# EasyEDA Pro project ProPrj_JoyStick_Base_控制&传感器PCB_2025-09-22.epro

# Schematic axleY_dhs_sch
Board Name: Board1
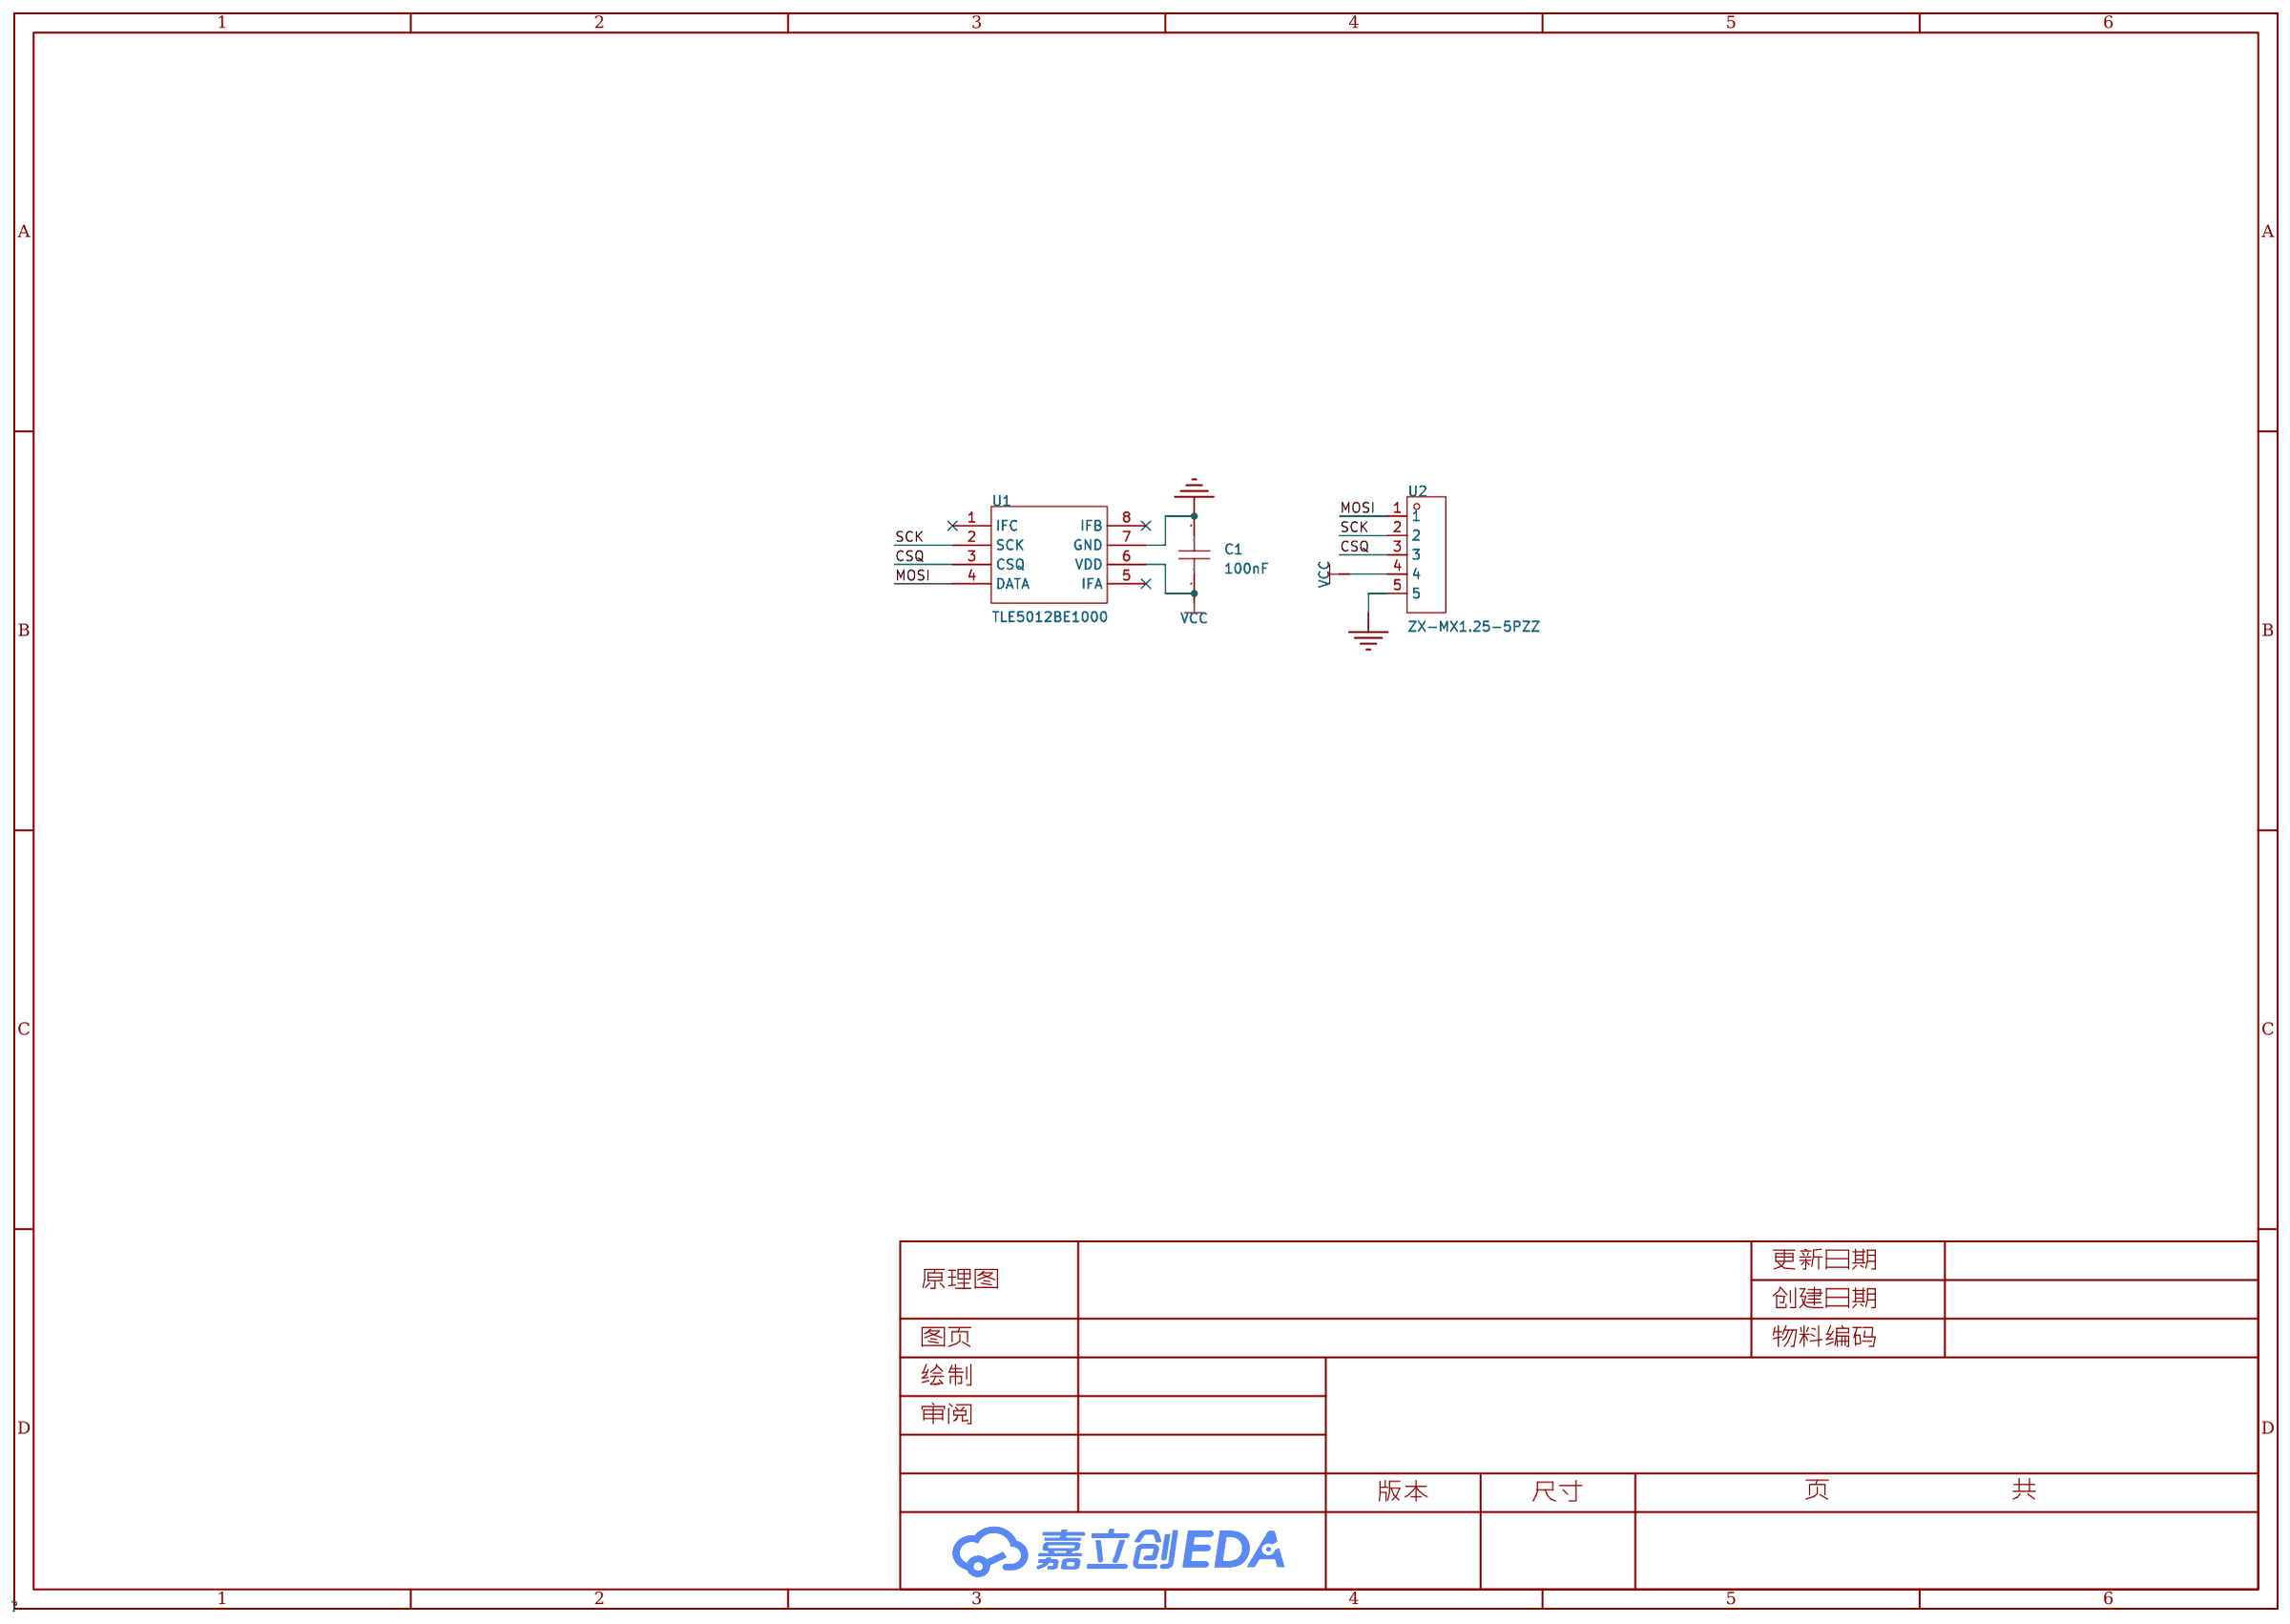
[diagram p0: schematic sheet]

## Parts
C1  100nF  [C0603]
U1  TLE5012BE1000  [PG-DSO-8_L5.0-W4.0-P1.27-LS6.0-BL]
U2  ZX-MX1.25-5PZZ  [CONN-TH_5P-P1.25_L3.2-W8.0]

## Library data of the parts
C1 = CGA0603X7R104K500JT: 容值:100nF;精度:±10%;额定电压:50V;材质(温度系数):X7R;; LCSC Part Name: 100nF ±10% 50V; Supplier Part: C6119867; Manufacturer: HRE(芯声); Supplier Footprint: 0603; JLCPCB Part Class: 扩展库; Supplier: LCSC; Tolerance: ±10%; Voltage Rated: 50V; Temperature Coefficient: X7R
U1 = TLE5012BE1000: 旋转角度范围:0°~360°;; Supplier Part: C123083; Manufacturer: Infineon(英飞凌); Supplier Footprint: SO-8; JLCPCB Part Class: 扩展库; Datasheet: https://atta.szlcsc.com/upload/public/pdf/source/20170728/C123083_1501225763065848823.pdf; Supplier: LCSC; Rotation Angle: 0°~360°
U2 = ZX-MX1.25-5PZZ: 插针结构:1x5P;间距:1.25mm;安装方式:直插;参考系列:-;总PIN数:5P;排数:1;每排PIN数:5;行距:-;额定电流:1A;触头材质:黄铜;触头镀层:锡;工作温度范围:-25℃~+85℃;; LCSC Part Name: 1x5P 间距:1.25mm 直插; Supplier Part: C7430461; Manufacturer: Megastar(兆星); Supplier Footprint: 插件,P=1.25mm; JLCPCB Part Class: Extended Part; Datasheet: https://atta.szlcsc.com/upload/public/pdf/source/20230619/834A82ADC0597DB6BA0EE0E3A3338474.pdf; Supplier: LCSC; Pins Structure: 1x5P; Pitch: 1.25mm; Mounting Style: 直插; Number of Pins: 5P; Number of Rows: 1; Number of PINs Per Row: 5; Current Rating (Max): 1A; Contact Material: 黄铜; Contact Plating: 锡; Operating Temperature Range: -25℃~+85℃

## Nets
GND: C1.2 U1.7(GND) U2.5
VCC: C1.1 U1.6(VDD) U2.4
CSQ: U1.3(CSQ) U2.3
MOSI: U1.4(DATA) U2.1
SCK: U1.2(SCK) U2.2

Not connected (* = marked no-connect by the designer): U1 1(IFC)* 5(IFA)* 8(IFB)*

# Schematic axleZ_dhs_sch
Board Name: Board2; Create Date: 2024-12-11; Page Name: P1; Project Name: JoyStick_Base_控制&传感器PCB; Schematic Name: axleZ_dhs_sch; Update Date: 2025-02-16; Company: 嘉立创EDA; Page Size: A4; Version: V1.0
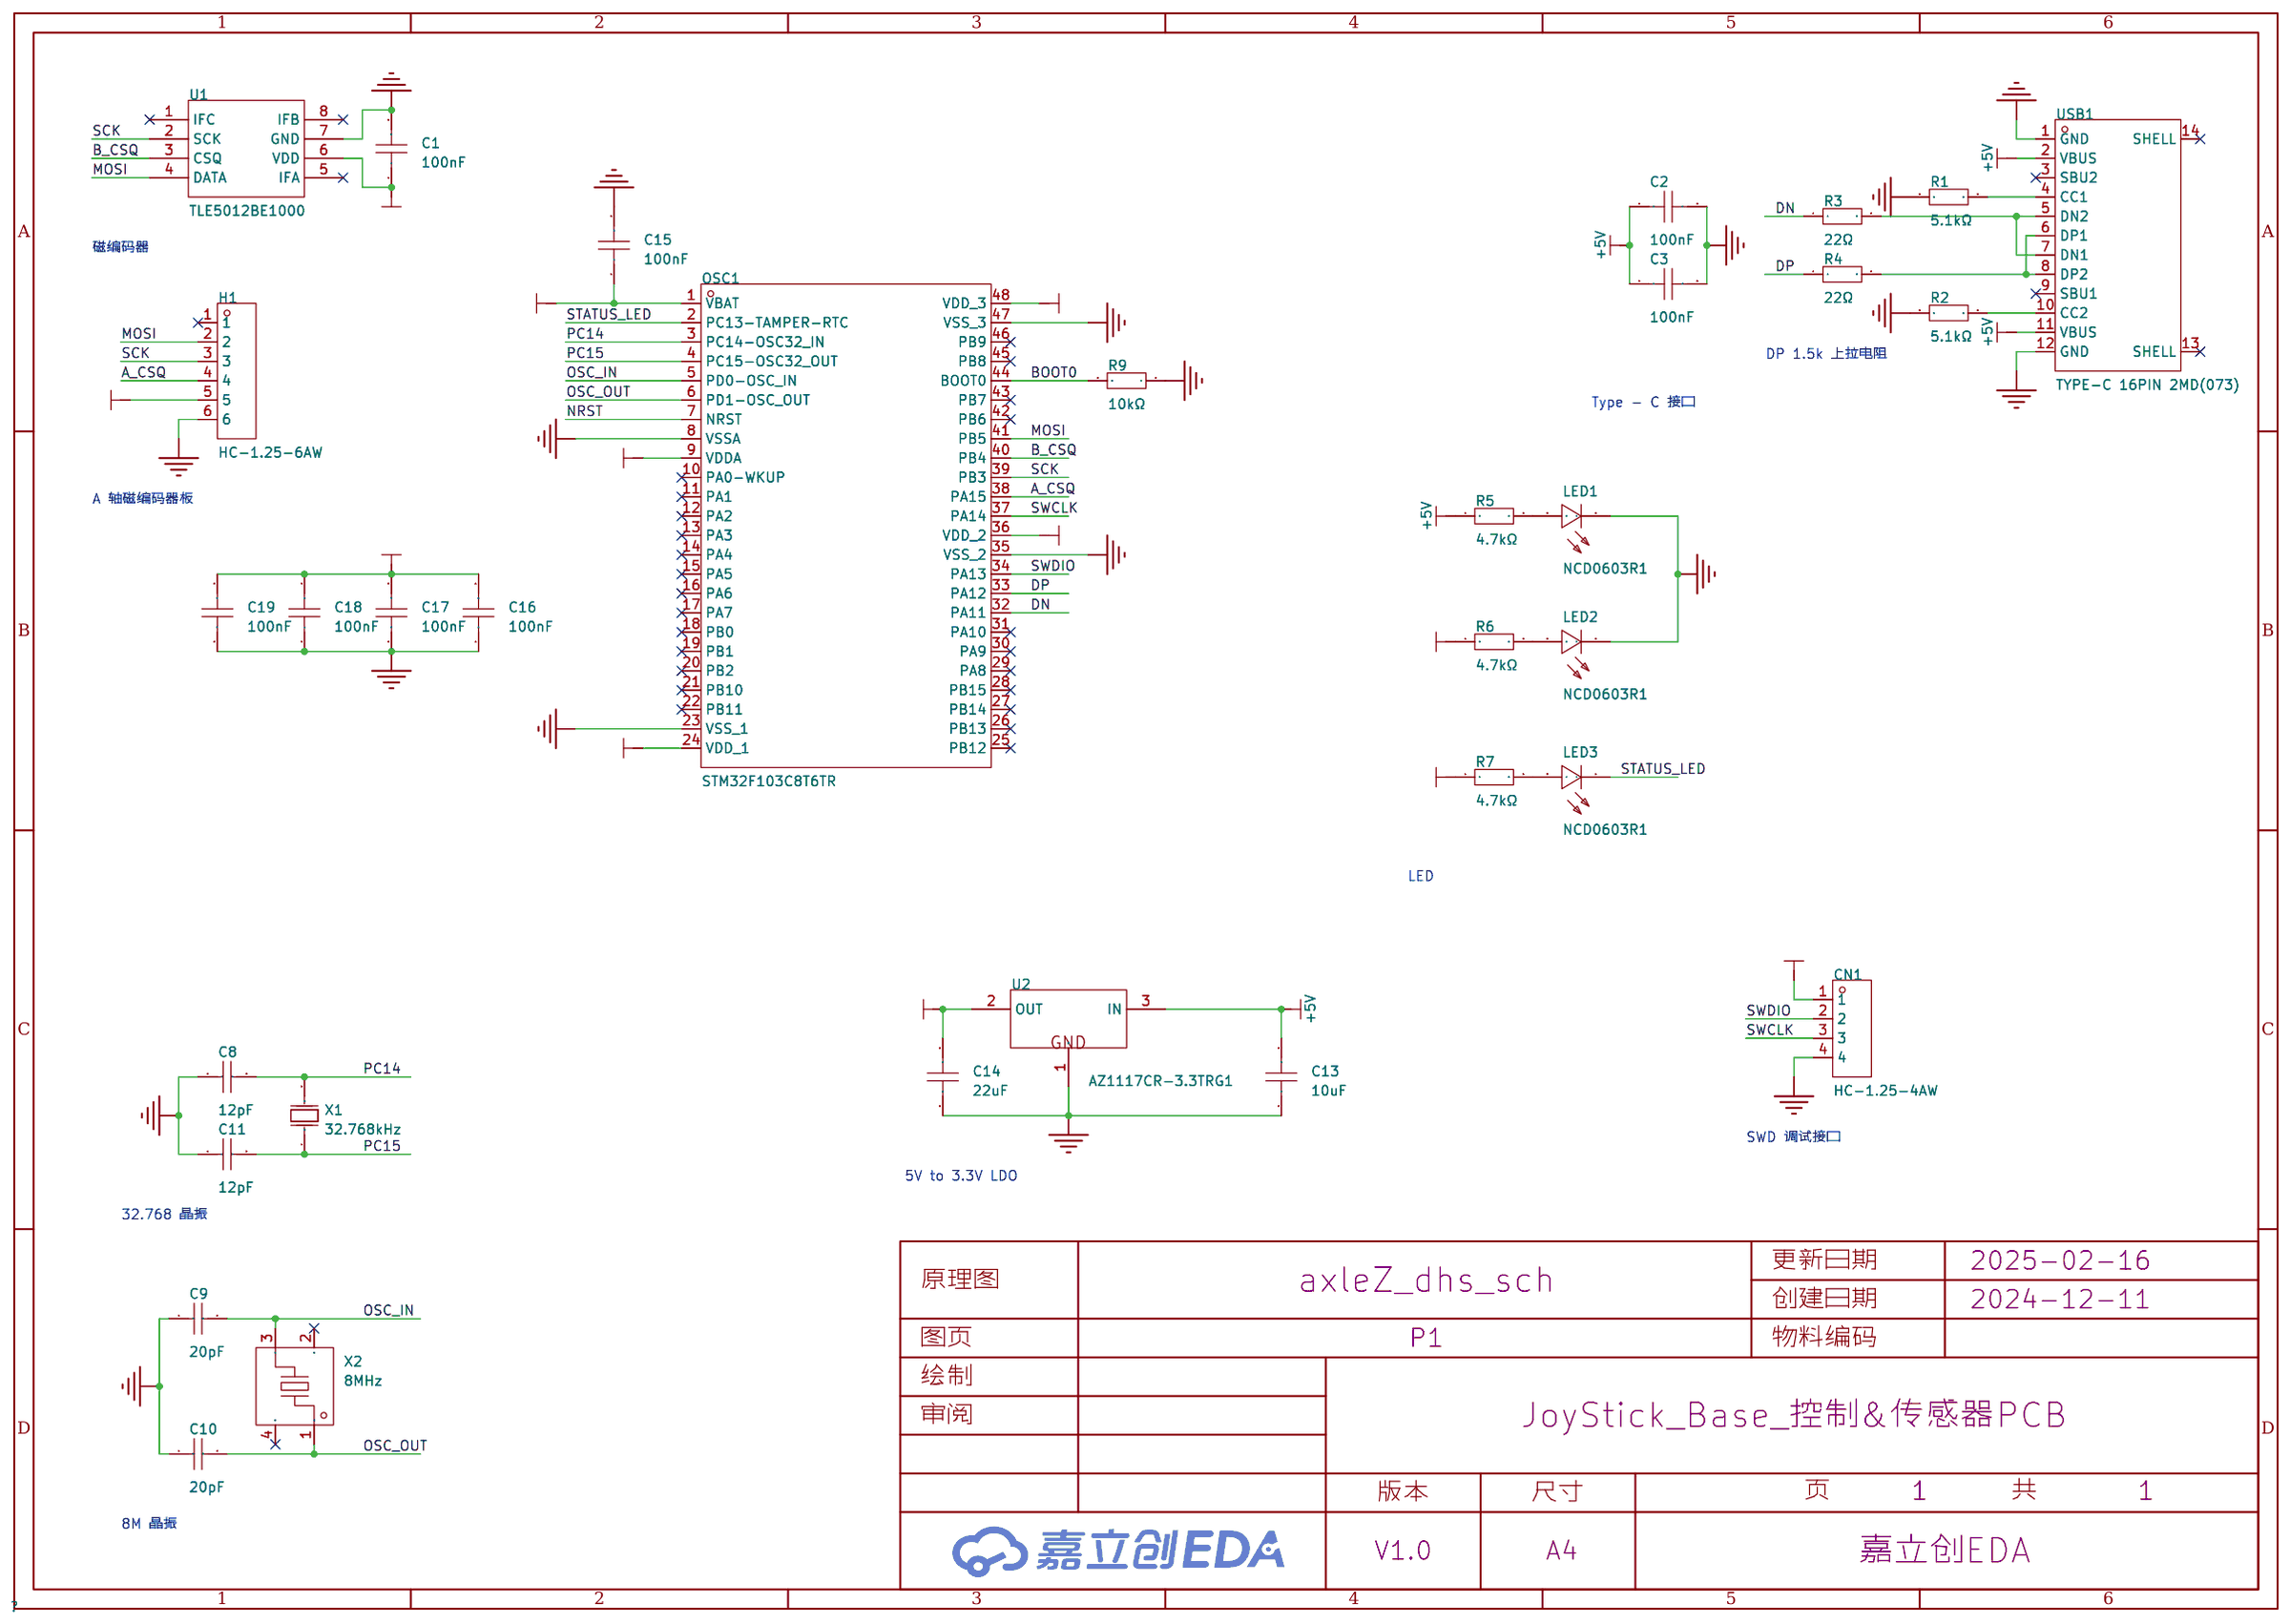
[diagram p1: schematic sheet]

## Parts
C1  100nF  [C0603]
C2  100nF  [C0603]
C3  100nF  [C0603]
C8  12pF  [C0603]
C9  20pF  [C0603]
C10  20pF  [C0603]
C11  12pF  [C0603]
C13  10uF  [C0603]
C14  22uF  [C0603]
C15  100nF  [C0603]
C16  100nF  [C0603]
C17  100nF  [C0603]
C18  100nF  [C0603]
C19  100nF  [C0603]
CN1  HC-1.25-4AW  [CONN-TH_4P-P1.25_HCTL_HC-1.25-4AW]
H1  HC-1.25-6AW  [CONN-TH_6P-P1.25_HCTL_HC-1.25-6AW]
LED1  NCD0603R1  [LED0603-RD_RED]
LED2  NCD0603R1  [LED0603-RD_RED]
LED3  NCD0603R1  [LED0603-RD_RED]
OSC1  STM32F103C8T6TR  [LQFP-48_L7.0-W7.0-P0.50-LS9.0-BL]
R1  5.1kΩ  [R0603]
R2  5.1kΩ  [R0603]
R3  22Ω  [R0603]
R4  22Ω  [R0603]
R5  4.7kΩ  [R0603]
R6  4.7kΩ  [R0603]
R7  4.7kΩ  [R0603]
R9  10kΩ  [R0603]
U1  TLE5012BE1000  [PG-DSO-8_L5.0-W4.0-P1.27-LS6.0-BL]
U2  AZ1117CR-3.3TRG1  [SOT-89-3_L4.5-W2.5-P1.50-LS4.2-BR]
USB1  TYPE-C 16PIN 2MD(073)  [USB-C-SMD_TYPE-C-6PIN-2MD-073]
X1  32.768kHz  [CRYSTAL-SMD_L3.2-W1.5-1]
X2  8MHz  [OSC-SMD_4P-L3.2-W2.5-BL]

## Library data of the parts
C1 C15-C19 = CGA0603X7R104K500JT: 容值:100nF;精度:±10%;额定电压:50V;材质(温度系数):X7R;; LCSC Part Name: 100nF ±10% 50V; Supplier Part: C6119867; Manufacturer: HRE(芯声); Supplier Footprint: 0603; JLCPCB Part Class: 扩展库; Supplier: LCSC; Tolerance: ±10%; Voltage Rated: 50V; Temperature Coefficient: X7R
C2 C3 = CC0603KRX7R9BB104: 容值:100nF;精度:±10%;额定电压:50V;材质(温度系数):X7R;; LCSC Part Name: 100nF ±10% 50V; Supplier Part: C14663; Manufacturer: YAGEO(国巨); Supplier Footprint: 0603; JLCPCB Part Class: 基础库; Datasheet: https://atta.szlcsc.com/upload/public/pdf/source/20180910/C282072_33301C7F631E79921B82A8DAC6BCC5B3.pdf; Supplier: LCSC; Tolerance: ±10%; Voltage Rated: 50V; Temperature Coefficient: X7R
C8 C11 = CL10C120JB8NNNC: 容值:12pF;精度:±5%;额定电压:50V;材质(温度系数):C0G;; LCSC Part Name: 12pF ±5% 50V; Supplier Part: C38523; Manufacturer: SAMSUNG(三星); Supplier Footprint: 0603; JLCPCB Part Class: 基础库; Datasheet: https://atta.szlcsc.com/upload/public/pdf/source/20160218/1457707763339.pdf; Supplier: LCSC; Tolerance: ±5%; Voltage Rated: 50V; Temperature Coefficient: C0G
C9 C10 = CL10C200JB8NNNC: 容值:20pF;精度:±5%;额定电压:50V;材质(温度系数):C0G;; LCSC Part Name: 20pF ±5% 50V; Supplier Part: C1648; Manufacturer: SAMSUNG(三星); Supplier Footprint: 0603; JLCPCB Part Class: 基础库; Datasheet: https://atta.szlcsc.com/upload/public/pdf/source/20160218/1457707763339.pdf; Supplier: LCSC; Tolerance: ±5%; Voltage Rated: 50V; Temperature Coefficient: C0G
C13 = CL10A106MA8NRNC: 容值:10uF;精度:±20%;额定电压:25V;材质(温度系数):X5R;; LCSC Part Name: 10uF ±20% 25V; Supplier Part: C96446; Manufacturer: SAMSUNG(三星); Supplier Footprint: 0603; JLCPCB Part Class: 基础库; Datasheet: https://atta.szlcsc.com/upload/public/pdf/source/20160218/1457707763339.pdf; Supplier: LCSC; Tolerance: ±20%; Voltage Rated: 25V; Temperature Coefficient: X5R
C14 = CGA0603X5R226M160JT: 容值:22uF;精度:±20%;额定电压:16V;材质(温度系数):X5R;; LCSC Part Name: 22uF ±20% 16V; Supplier Part: C6119868; Manufacturer: HRE(芯声); Supplier Footprint: 0603; JLCPCB Part Class: 扩展库; Supplier: LCSC; Tolerance: ±20%; Voltage Rated: 16V; Temperature Coefficient: X5R
CN1 = HC-1.25-4AW: 插针结构:1x4P;间距:1.25mm;安装方式:弯插;参考系列:PicoBlade(MX 1.25);总PIN数:4P;排数:1;每排PIN数:4;行距:-;额定电流:1A;触头材质:黄铜;触头镀层:锡;工作温度范围:-25℃~+85℃;; LCSC Part Name: 1x4P 间距:1.25mm 弯插 系列:PicoBlade(MX 1.25); Supplier Part: C2845537; Manufacturer: HCTL(华灿天禄); Supplier Footprint: 弯插,P=1.25mm; JLCPCB Part Class: 扩展库; Datasheet: https://atta.szlcsc.com/upload/public/pdf/source/20230707/04F6BEA69F699E7BB6558EF06AF1DC24.pdf; Supplier: LCSC; Pins Structure: 1x4P; Pitch: 1.25mm; Mounting Style: 弯插; Reference Series: PicoBlade(MX 1.25); Number of Pins: 4P; Number of Rows: 1; Number of PINs Per Row: 4; Current Rating (Max): 1A; Contact Material: 黄铜; Contact Plating: 锡; Operating Temperature Range: -25℃~+85℃; Rated Voltage (Max): 125V; Plastic Material: PA46; Flame Retardant Rating: UL94V-0; Z-Height of the Board: 3.2mm; X-Length of Bottom Edge on Board (Spacing Line): 6.75mm; Y-Width of Bottom Edge on Board: 4.7mm
H1 = HC-1.25-6AW: 插针结构:1x6P;间距:1.25mm;安装方式:弯插;参考系列:PicoBlade(MX 1.25);总PIN数:6P;排数:1;每排PIN数:6;行距:-;额定电流:1A;触头材质:黄铜;触头镀层:锡;工作温度范围:-25℃~+85℃;; LCSC Part Name: 1x6P 间距:1.25mm 弯插 系列:PicoBlade(MX 1.25); Supplier Part: C2845539; Manufacturer: HCTL(华灿天禄); Supplier Footprint: 弯插,P=1.25mm; JLCPCB Part Class: Extended Part; Datasheet: https://atta.szlcsc.com/upload/public/pdf/source/20230707/04F6BEA69F699E7BB6558EF06AF1DC24.pdf; Supplier: LCSC; Pins Structure: 1x6P; Pitch: 1.25mm; Mounting Style: 弯插; Reference Series: PicoBlade(MX 1.25); Number of Pins: 6P; Number of Rows: 1; Number of PINs Per Row: 6; Current Rating (Max): 1A; Contact Material: 黄铜; Contact Plating: 锡; Operating Temperature Range: -25℃~+85℃; Rated Voltage (Max): 125V; Plastic Material: PA46; Flame Retardant Rating: UL94V-0; Z-Height of the Board: 3.2mm; X-Length of Bottom Edge on Board (Spacing Line): 9.25mm; Y-Width of Bottom Edge on Board: 4.7mm; Pin Structure: 1x6P; Circluar Pins/Square Pins: 方针; Mounting Type: 直插; Length of Mating Pin: 6mm; Insulation Height: 2.5mm; Length of End Connection Pin: 3mm; Color: 黑色
LED1-LED3 = NCD0603R1_C84263: 灯头类型:-;发光颜色:红色;正向电压(VF):1.6V~2.6V;功率:65mW;正向电流:20mA;主波长:615nm~630nm;二极管配置:独立二极管;透镜颜色:无色透明透镜;色温:-;发光强度:80mcd~220mcd;发光角度:130°;载带方式:-;工作温度:-30℃~+85℃;; Supplier Part: C84263; Manufacturer: 国星光电; Supplier Footprint: 0603; JLCPCB Part Class: 扩展库; Datasheet: https://atta.szlcsc.com/upload/public/pdf/source/20200820/C84263_DABC6A75E58F576973B407FDBA283D60.pdf; Supplier: LCSC; Emitted Color: 红色; Forward Voltage (VF): 1.6V~2.6V; Power Dissipation: 65mW; Forward Current: 20mA; Dominant Wavelength: 615nm~630nm; Diode Configuration: 独立二极管; Lens Color: 无色透明透镜; Luminous Intensity: 80mcd~220mcd; Viewing Angle: 130°; Operating Temperature: -30℃~+85℃
OSC1 = STM32F103C8T6TR: CPU内核:ARM-M3;应用领域:-;; LCSC Part Name: 主流增强型ARM Cortex-M3 MCU，具有64 KB Flash、72 MHz CPU、电机控制、USB和CAN; Supplier Part: C2969777; Manufacturer: ST(意法半导体); Supplier Footprint: LQFP-48(7x7); JLCPCB Part Class: 扩展库; Datasheet: https://atta.szlcsc.com/upload/public/pdf/source/20220628/95EE8CB51361BFD20205E6D0986143A8.pdf; Supplier: LCSC; CPU Core: ARM-M3
R1 R2 R5-R7 R9 = 0603WAF5101T5E: 电阻类型:厚膜电阻;阻值:5.1kΩ;精度:±1%;功率:100mW;最大工作电压:75V;温度系数:±100ppm/℃;; LCSC Part Name: 5.1kΩ ±1% 100mW 厚膜电阻; Supplier Part: C23186; Manufacturer: UNI-ROYAL(厚声); Supplier Footprint: 0603; JLCPCB Part Class: 基础库; Datasheet: https://atta.szlcsc.com/upload/public/pdf/source/20200306/C422600_1E6D84923E4A46A82E41ADD87F860B5C.pdf; Supplier: LCSC; Type: 厚膜电阻; Tolerance: ±1%; Power(Watts): 100mW; Overload Voltage (Max): 75V; Temperature Coefficient: ±100ppm/℃; Operating Temperature Range: -55℃~+155℃
R3 R4 = 0603WAF220JT5E: 电阻类型:厚膜电阻;阻值:22Ω;精度:±1%;功率:100mW;最大工作电压:75V;温度系数:±100ppm/℃;; LCSC Part Name: 22Ω ±1% 100mW 厚膜电阻; Supplier Part: C23345; Manufacturer: UNI-ROYAL(厚声); Supplier Footprint: 0603; JLCPCB Part Class: 基础库; Datasheet: https://atta.szlcsc.com/upload/public/pdf/source/20200306/C422600_1E6D84923E4A46A82E41ADD87F860B5C.pdf; Supplier: LCSC; Type: 厚膜电阻; Tolerance: ±1%; Power(Watts): 100mW; Overload Voltage (Max): 75V; Temperature Coefficient: ±100ppm/℃; Operating Temperature Range: -55℃~+155℃
U1 = TLE5012BE1000: 旋转角度范围:0°~360°;; Supplier Part: C123083; Manufacturer: Infineon(英飞凌); Supplier Footprint: SO-8; JLCPCB Part Class: 扩展库; Datasheet: https://atta.szlcsc.com/upload/public/pdf/source/20170728/C123083_1501225763065848823.pdf; Supplier: LCSC; Rotation Angle: 0°~360°
U2 = AZ1117CR-3.3TRG1: 输出类型:固定;最大输入电压:15V;输出电压:3.3V;输出电流:800mA;电源纹波抑制比(PSRR):70dB@(120Hz);输出极性:正极;; LCSC Part Name: 输入15V 输出3.3V 800mA; Supplier Part: C460428; Manufacturer: DIODES(美台); Supplier Footprint: SOT-89-3; JLCPCB Part Class: 扩展库; Datasheet: https://atta.szlcsc.com/upload/public/pdf/source/20200113/C481691_4CA85A195C85BD5111869557270CCBB7.pdf; Supplier: LCSC; Output Type: 固定; Maximum Input Voltage: 15V; Output Voltage: 3.3V; Output Current: 800mA; Power Supply Rejection Ratio (PSRR): 70dB@(120Hz); standby current: 6mA; Feature: 防静电保护；低ESR；热保护(TSD)；过流保护(OCP); Operating Temperature: -20℃~+125℃@(Tj); Output Polarity: 正极; Number of Outputs: 1
USB1 = TYPE-C 16PIN 2MD(073): 连接器类型:Type-C;标准:USB 3.1;公母:母;安装方式:卧贴;触点数量:16P;端口数量:1;额定电流 - 电源:5A;工作温度范围:-25℃~+85℃;; LCSC Part Name: Type-C 母 卧贴; Supplier Part: C2765186; Manufacturer: SHOU HAN(首韩); Supplier Footprint: SMD; JLCPCB Part Class: 扩展库; Datasheet: https://atta.szlcsc.com/upload/public/pdf/source/20211123/39B17C16241EAC15C5E277BDA434118E.pdf; Supplier: LCSC; Connector Type: Type-C; Standard: USB 3.1; Gender: 母; Mounting Style: 卧贴; Number of Contacts: 16P; Number of Ports: 1; Current Rating - Power (Max): 5A; Operating Temperature Range: -25℃~+85℃; Rated Voltage (Max): 5V; Connect-Disconnect Life: 5千次; Core Colour: 黑色
X1 = XKXGI-SUA-32.768K: 晶振类型:贴片晶振;频率:32.768kHz;常温频差:±20ppm;外接负载电容:12.5pF;频率稳定度(全温):±30ppm;; LCSC Part Name: 32.768kHz ±20ppm 12.5pF YST310S; Supplier Part: C5213671; Manufacturer: YXC(扬兴晶振); Supplier Footprint: SMD3215-2P; JLCPCB Part Class: 扩展库; Datasheet: https://atta.szlcsc.com/upload/public/pdf/source/20240329/3A7650FD985DD0DE85694D3785AB4916.pdf; Supplier: LCSC; Crystal Type: 贴片晶振; Normal temperature Frequency Tolerance: ±20ppm; External load capacitor: 12.5pF; Frequency Stability(Full temperature range): ±30ppm; Operating Temperature: -40℃~+85℃
X2 = X32258MOB4SI: 晶振类型:贴片晶振;频率:8MHz;常温频差:±10ppm;外接负载电容:12pF;频率稳定度(全温):±20ppm;; LCSC Part Name: 8MHz ±10ppm 12pF; Supplier Part: C2682775; Manufacturer: YXC(扬兴晶振); Supplier Footprint: SMD3225-4P; JLCPCB Part Class: 扩展库; Datasheet: https://atta.szlcsc.com/upload/public/pdf/source/20240329/19D5F850207469550BEB00D7DFEDBC7A.pdf; Supplier: LCSC; Crystal Type: 贴片晶振; Normal temperature Frequency Tolerance: ±10ppm; External load capacitor: 12pF; Frequency Stability(Full temperature range): ±20ppm; Equivalent Series Resistance (ESR): 150Ω; Operating Temperature: -40℃~+85℃

## Nets
3.3V: C1.1 C14.2 C15.1 C16.2 C17.2 C18.2 C19.2 CN1.1 H1.5 OSC1.1(VBAT) OSC1.9(VDDA) OSC1.24(VDD_1) OSC1.36(VDD_2) OSC1.48(VDD_3) R6.1 R7.1 U1.6(VDD) U2.2(OUT)
+5V: C2.1 C3.1 C13.2 R5.1 U2.3(IN) USB1.2(VBUS) USB1.11(VBUS)
GND: C1.2 C2.2 C3.2 C8.1 C9.1 C10.1 C11.1 C13.1 C14.1 C15.2 C16.1 C17.1 C18.1 C19.1 CN1.4 H1.6 LED1.1(K) LED2.1(K) OSC1.8(VSSA) OSC1.23(VSS_1) OSC1.35(VSS_2) OSC1.47(VSS_3) R1.1 R2.1 R9.1 U1.7(GND) U2.1(GND) USB1.1(GND) USB1.12(GND)
A_CSQ: H1.4 OSC1.38(PA15)
B_CSQ: OSC1.40(PB4) U1.3(CSQ)
BOOT0: OSC1.44(BOOT0) R9.2
DN: OSC1.32(PA11) R3.1
DP: OSC1.33(PA12) R4.1
MOSI: H1.2 OSC1.41(PB5) U1.4(DATA)
NRST: OSC1.7(NRST)
OSC_IN: C9.2 OSC1.5(PD0-OSC_IN) X2.3
OSC_OUT: C10.2 OSC1.6(PD1-OSC_OUT) X2.1
PC14: C8.2 OSC1.3(PC14-OSC32_IN) X1.2(OSC2)
PC15: C11.2 OSC1.4(PC15-OSC32_OUT) X1.1(OSC1)
SCK: H1.3 OSC1.39(PB3) U1.2(SCK)
STATUS_LED: LED3.1(K) OSC1.2(PC13-TAMPER-RTC)
SWCLK: CN1.3 OSC1.37(PA14)
SWDIO: CN1.2 OSC1.34(PA13)
$1N1867: R2.2 USB1.10(CC2)
$1N1871: R1.2 USB1.4(CC1)
$1N2021: R3.2 USB1.5(DN2) USB1.7(DN1)
$1N2036: R4.2 USB1.6(DP1) USB1.8(DP2)
$1N2587: LED1.2(A) R5.2
$1N2706: LED2.2(A) R6.2
Net-(LED3-2): LED3.2(A) R7.2

Not connected (* = marked no-connect by the designer): H1 1*; OSC1 10(PA0-WKUP)* 11(PA1)* 12(PA2)* 13(PA3)* 14(PA4)* 15(PA5)* 16(PA6)* 17(PA7)* 18(PB0)* 19(PB1)* 20(PB2)* 21(PB10)* 22(PB11)* 25(PB12)* 26(PB13)* 27(PB14)* 28(PB15)* 29(PA8)* 30(PA9)* 31(PA10)* 42(PB6)* 43(PB7)* 45(PB8)* 46(PB9)*; U1 1(IFC)* 5(IFA)* 8(IFB)*; USB1 3(SBU2)* 9(SBU1)* 13(SHELL)* 14(SHELL)*; X2 2(GND)* 4(GND)*

## Notes on the sheet
- 磁编码器
- DP 1.5k 上拉电阻
- Type - C 接口
- A 轴磁编码器板
- LED
- SWD 调试接口
- 5V to 3.3V LDO
- 32.768 晶振
- 8M 晶振

# Board axleY_dhs_pcb
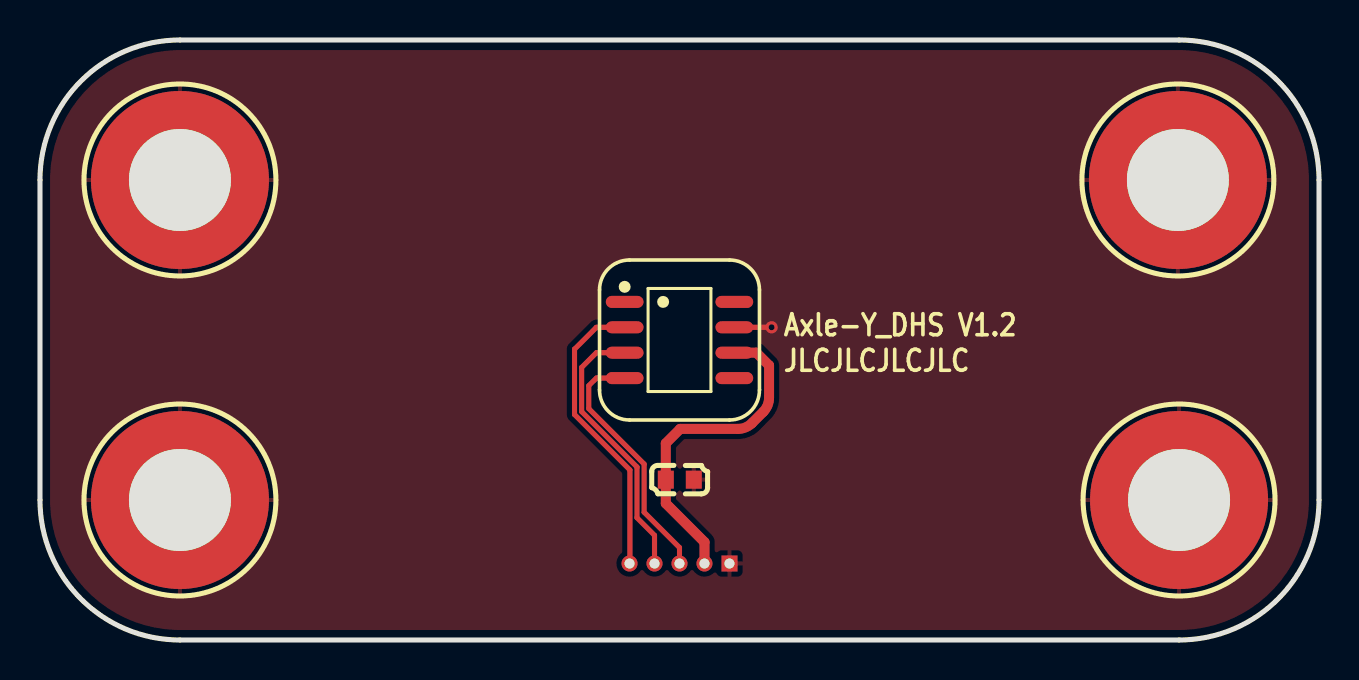
[diagram p2: board, top side]
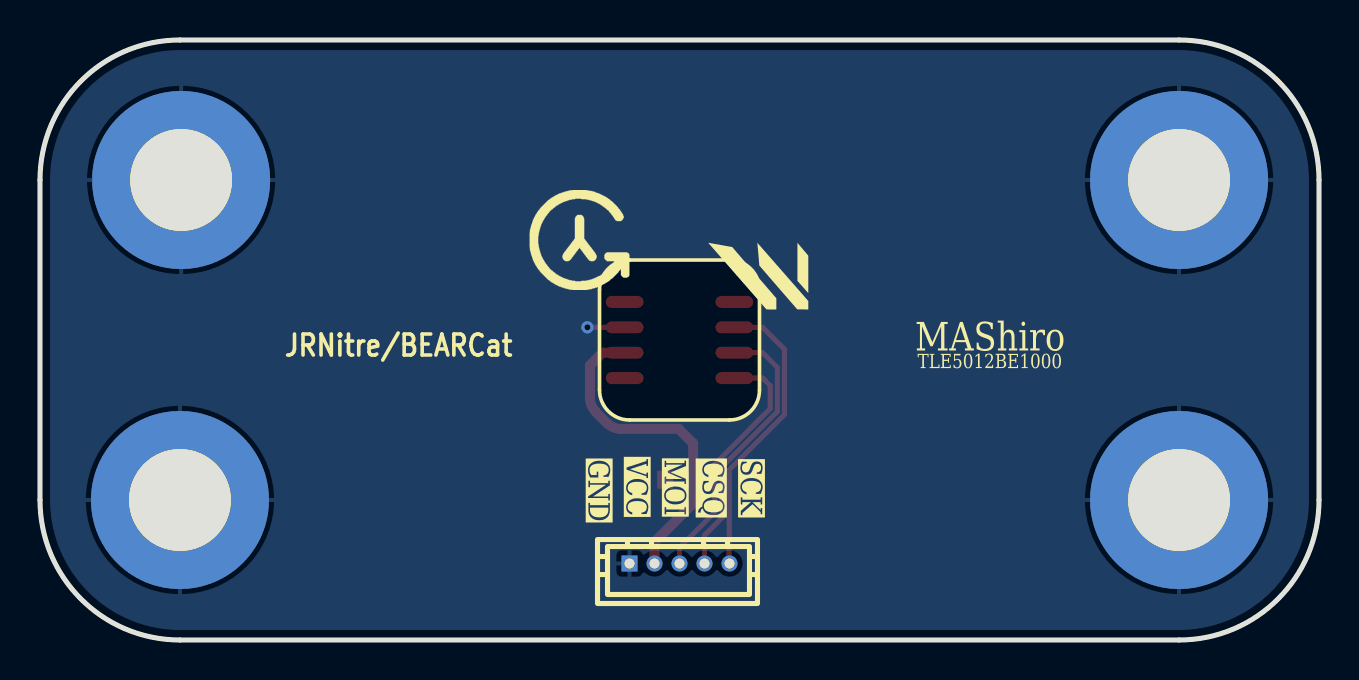
[diagram p3: board, bottom side, seen from below]

Outline 63.97 x 30 mm; copper layers: Top Layer, Bottom Layer. Coordinates in mm from the lower left corner of the outline.
Outline path: 0,23 arc(2.05,27.95) 7,30 56.97,30 arc(61.92,27.95) 63.97,23 63.97,7 arc(61.92,2.05) 56.97,0 7,0 arc(2.05,2.05) 0,7 0,23
Stack: Top Layer 0.035mm / Dielectric1 1.51mm FR4 er 4.5 / Bottom Layer 0.035mm

## Design rules (mm)
template: 自定义配置
spacing copperThickness1oz (default): track to track 0.102, other pairs 0.152 to 0.3
spacing copperThickness2oz: track to track 0.203, other pairs 0.152 to 0.3
track width copperThickness1oz (default): min 0.127, default 0.254, max 2.54
track width copperThickness2oz: min 0.203, default 0.254, max 2.54
differential pair differentialPair (default): width min 0.127, default 0.254, max 2.54; gap min 0.152, default 0.152
via viaSize (default): diameter min 0.5, default 0.61, max 10; hole min 0.3, default 0.305, max 6.3

## Placement (name value [footprint] x y rotation side)
C1  100nF  [C0603]  32 8.02 0 top
U1  TLE5012BE1000  [PG-DSO-8_L5.0-W4.0-P1.27-LS6.0-BL]  31.98 15 270 top
U2  ZX-MX1.25-5PZZ  [M5螺丝孔]  7 7 0 top
U2#2  -  [M5螺丝孔]  7 23 0 top
U2#3  -  [M5螺丝孔]  56.91 23 0 top
U2#4  -  [M5螺丝孔]  56.97 7 0 top
U2#5  -  [CONN-TH_5P-P1.25_L3.2-W8.0]  31.98 3.82 180 bottom

## Footprints (pads in the part's own frame, mm; a bottom-side part is the same pattern mirrored in y, then rotated)
C0603
  rect 0.8x0.9 smd: 1(-0.7,0) 2(0.7,0)
CONN-TH_5P-P1.25_L3.2-W8.0
  rect 0.8x0.8 hole 0.5: 1(-2.5,0)
  round 0.8 hole 0.5: 2(-1.25,0) 3(0,0) 4(1.25,0) 5(2.5,0)
M5螺丝孔
  round 8.9 hole 5.1: 1(0,0)
PG-DSO-8_L5.0-W4.0-P1.27-LS6.0-BL
  oval 0.602x1.885 smd: 1(-1.905,-2.743) 2(-0.635,-2.743) 3(0.635,-2.743) 4(1.905,-2.743) 5(1.905,2.743) 6(0.635,2.743) 7(-0.635,2.743) 8(-1.905,2.743)

## Nets
GND: C1.2 U1.7 U2.1 U2#2.1 U2#3.1 U2#4.1 U2#5.1
VCC: C1.1 U1.6 U2#5.2
CSQ: U1.3 U2#5.4
MOSI: U1.4 U2#5.3
SCK: U1.2 U2#5.5

Pads without a net: U1 1 5 8

## Via types
v1: diameter 0.61, hole 0.305, Top Layer to Bottom Layer, 1 via

## Routing (per net, layer and track width the routed paths; a pad name or vN(x,y) marks a point on that pad's centre or on a via; arc(x,y) is an arc through that point)
GND: length 1.9
  Top Layer w0.254: U1.7 v1(36.59,15.64)
VCC: length 16.7
  Top Layer w0.5: U2#5.2 33.23,4.89 31.3,6.83 C1.1 31.3,9.84 32.02,10.56 34.91,10.56 arc(35.29,10.63) 35.61,10.85 36.17,11.41 arc(36.39,11.73) 36.46,12.11 36.46,13.73 35.83,14.37 34.73,14.37
CSQ: length 13.8
  Top Layer w0.254: 29.24,14.37 27.83,14.37 27.09,13.63 27.09,11.42 29.86,8.65 29.86,6.11 30.73,5.24 U2#5.4
MOSI: length 12.7
  Top Layer w0.254: U1.4 27.83,13.1 27.45,12.71 27.45,11.57 30.22,8.8 30.22,6.39 31.98,4.62 U2#5.3
SCK: length 14.8
  Top Layer w0.254: U2#5.5 29.5,3.84 29.5,8.5 26.73,11.27 26.73,14.54 27.83,15.64 U1.2

## Copper pours and planes (outline as drawn; the poured copper is in the pictures)
GND on Top Layer: 0.02,29.99 63.97,29.99 63.97,0 0.02,0
GND on Bottom Layer: 0.02,29.99 63.97,29.99 63.97,0 0.02,0

## Text on the board
Bottom Silkscreen Layer: JRNitre/BEARCat | MAShiro | TLE5012BE1000 | SCK | CSQ | MOI | VCC | GND
Top Silkscreen Layer: Axle-Y_DHS V1.2 | JLCJLCJLCJLC

# Board axleZ_dhs_sch
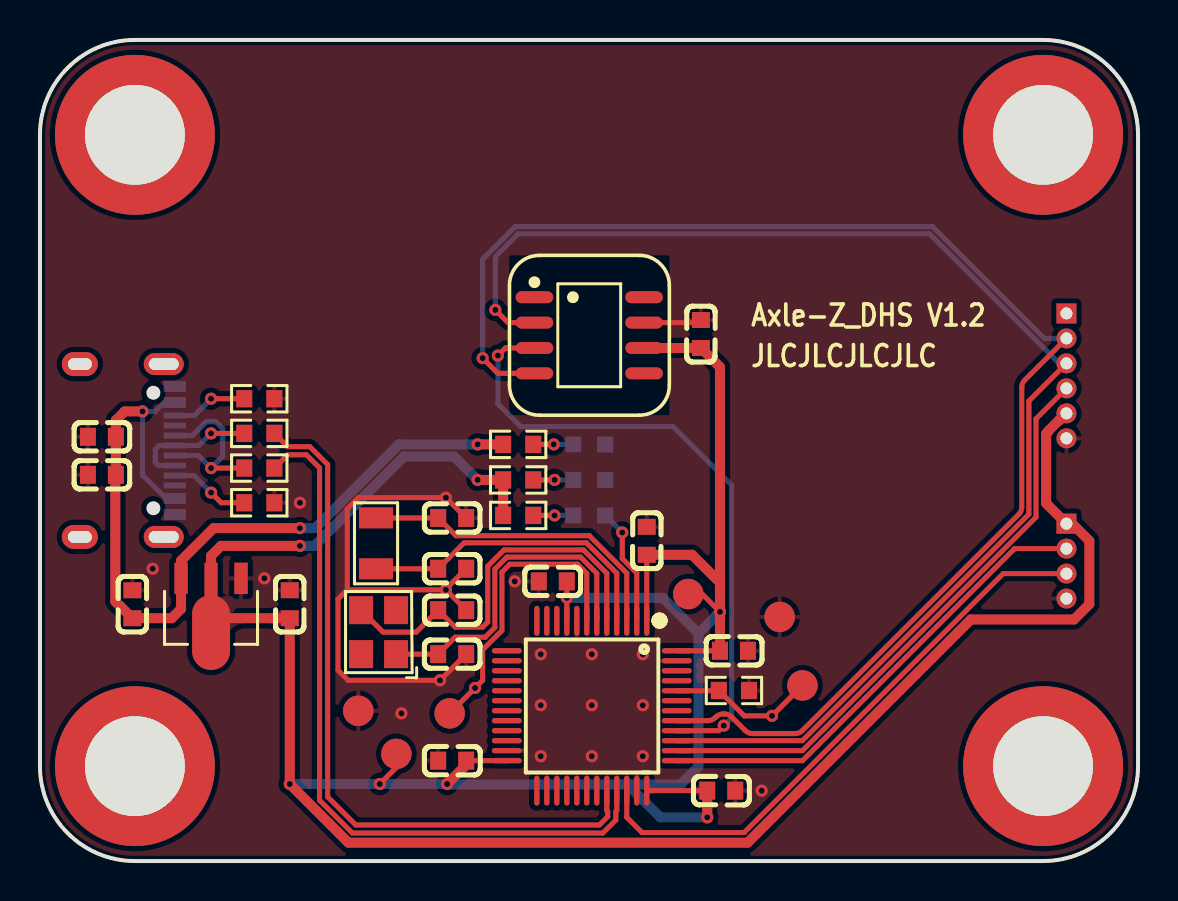
[diagram p4: board, top side]
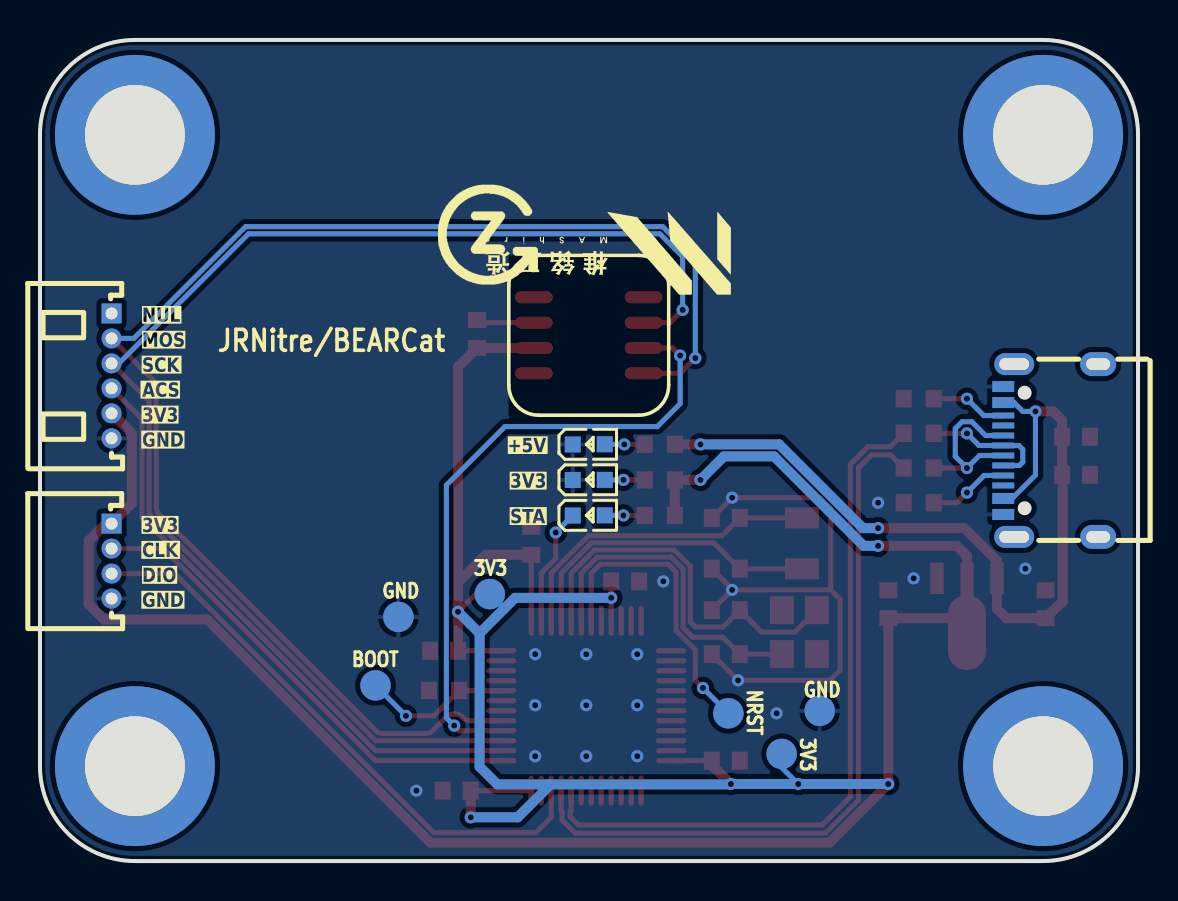
[diagram p5: board, bottom side, seen from below]

Outline 54.94 x 41.1 mm; copper layers: Top Layer, Bottom Layer. Coordinates in mm from the lower left corner of the outline.
Outline path: 0,36.35 arc(1.39,39.71) 4.75,41.1 50.19,41.1 arc(53.55,39.71) 54.94,36.35 54.94,4.75 arc(53.55,1.39) 50.19,0 4.75,0 arc(1.39,1.39) 0,4.75 0,36.35
Stack: Top Layer 0.035mm / Dielectric1 1.51mm FR4 er 4.5 / Bottom Layer 0.035mm

## Design rules (mm)
net DN: DP1
net DP: DP1
template: JLCPCB Capability(Two Layers Board)
spacing copperThickness1oz (default): track to track 0.102, other pairs 0.152 to 0.3
spacing copperThickness2oz: track to track 0.203, other pairs 0.152 to 0.3
track width copperThickness1oz (default): min 0.127, default 0.254, max 2.54
track width copperThickness2oz: min 0.203, default 0.254, max 2.54
differential pair differentialPair (default): width min 0.127, default 0.254, max 2.54; gap min 0.152, default 0.152
via viaSize (default): diameter min 0.5, default 0.61, max 10; hole min 0.3, default 0.305, max 6.3

## Placement (name value [footprint] x y rotation side)
C1  100nF  [C0603]  33.07 26.38 90 top
C2  100nF  [C0603]  3.1 19.33 180 top
C3  100nF  [C0603]  3.1 21.24 180 top
C8  12pF  [C0603]  20.62 17.17 180 top
C9  20pF  [C0603]  20.62 12.56 180 top
C10  20pF  [C0603]  20.62 10.36 180 top
C11  12pF  [C0603]  20.62 14.63 180 top
C13  10uF  [C0603]  4.62 12.85 270 top
C14  22uF  [C0603]  12.5 12.85 270 top
C15  100nF  [C0603]  20.62 5.02 180 top
C16  100nF  [C0603]  34.09 3.52 180 top
C17  100nF  [C0603]  34.72 10.52 180 top
C18  100nF  [C0603]  30.36 16.03 270 top
C19  100nF  [C0603]  25.66 14 0 top
CN1  HC-1.25-4AW  [CONN-TH_4P-P1.25_HCTL_HC-1.25-4AW]  51.36 15.01 270 bottom
H1  HC-1.25-6AW  [CONN-TH_6P-P1.25_HCTL_HC-1.25-6AW]  51.36 24.28 270 bottom
LED1  NCD0603R1  [LED0603-RD_RED]  27.48 20.86 180 bottom
LED2  NCD0603R1  [LED0603-RD_RED]  27.48 19.08 180 bottom
NOREF  -  [Pad_e1124]  38.15 8.79 0 top
NOREF#2  -  [Pad_e1204]  17.83 5.36 0 top
NOREF#3  -  [Pad_e1225]  15.93 7.52 0 top
NOREF#4  -  [Pad_e1218]  37.01 12.22 0 top
NOREF#5  -  [Pad_e1224]  15.93 7.52 0 top
NOREF#6  -  [Pad_e1223]  37.01 12.22 0 top
NOREF#7  -  [Pad_e1207]  17.83 5.36 0 top
NOREF#8  -  [Pad_e1185]  20.5 7.39 0 top
NOREF#9  -  [Pad_e1229]  32.44 13.36 0 top
NOREF#10  -  [Pad_e1228]  32.44 13.36 0 top
NOREF#11  -  [Pad_e1126]  38.15 8.79 0 top
NOREF#12  -  [Pad_e1198]  20.5 7.39 0 top
OSC1  STM32F103C8T6TR  [LQFP-48_L7.0-W7.0-P0.50-LS9.0-BL]  27.61 7.77 180 top
R1  5.1kΩ  [R0603]  10.97 17.93 180 top
R2  5.1kΩ  [R0603]  10.97 23.14 180 top
R3  22Ω  [R0603]  10.97 21.41 180 top
R4  22Ω  [R0603]  10.97 19.67 180 top
R5  4.7kΩ  [R0603]  23.93 20.86 0 top
R6  4.7kΩ  [R0603]  23.93 19.08 0 top
R7  4.7kΩ  [R0603]  23.93 17.3 0 top
R9  10kΩ  [R0603]  34.72 8.54 180 top
STATUS  NCD0603R1  [LED0603-RD_RED]  27.48 17.3 180 bottom
U1  TLE5012BE1000  [PG-DSO-8_L5.0-W4.0-P1.27-LS6.0-BL]  27.48 26.32 270 top
U2  AZ1117CR-3.3TRG1  [M5螺丝]  4.75 4.75 0 top
U2#2  -  [M5螺丝]  50.19 36.35 0 top
U2#3  -  [M5螺丝]  50.19 4.75 0 top
U2#4  -  [M5螺丝]  4.75 36.35 0 top
U2#5  -  [SOT-89-3_L4.5-W2.5-P1.50-LS4.2-BR]  8.56 12.8 90 top
USB1  TYPE-C 16PIN 2MD(073)  [USB-C-SMD_TYPE-C-6PIN-2MD-073]  4.37 20.55 90 bottom
X1  32.768kHz  [CRYSTAL-SMD_L3.2-W1.5-1]  16.81 15.9 90 top
X2  8MHz  [OSC-SMD_4P-L3.2-W2.5-BL]  16.94 11.46 90 top

## Footprints (pads in the part's own frame, mm; a bottom-side part is the same pattern mirrored in y, then rotated)
C0603
  rect 0.8x0.9 smd: 1(-0.7,0) 2(0.7,0)
CONN-TH_4P-P1.25_HCTL_HC-1.25-4AW
  rect 1x1 hole 0.6: 1(-1.875,0)
  round 1 hole 0.6: 2(-0.625,0) 3(0.625,0) 4(1.875,0)
CONN-TH_6P-P1.25_HCTL_HC-1.25-6AW
  rect 1x1 hole 0.6: 1(-3.125,0)
  round 1 hole 0.6: 2(-1.875,0) 3(-0.625,0) 4(0.625,0) 5(1.875,0) 6(3.125,0)
CRYSTAL-SMD_L3.2-W1.5-1
  rect 1.05x1.7 smd: 1(-1.275,0) 2(1.275,0)
LED0603-RD_RED
  rect 0.8x0.8 smd: 1(-0.799,-0.004) 2(0.799,0.004)
LQFP-48_L7.0-W7.0-P0.50-LS9.0-BL
  oval 0.27x1.5 smd: 1(-2.75,-4.25) 2(-2.25,-4.25) 3(-1.75,-4.25) 4(-1.25,-4.25) 5(-0.75,-4.25) 6(-0.25,-4.25) 7(0.25,-4.25) 8(0.75,-4.25) 9(1.25,-4.25) 10(1.75,-4.25) 11(2.25,-4.25) 12(2.75,-4.25) 25(2.75,4.25) 26(2.25,4.25) 27(1.75,4.25) 28(1.25,4.25) 29(0.75,4.25) 30(0.25,4.25) 31(-0.25,4.25) 32(-0.75,4.25) 33(-1.25,4.25) 34(-1.75,4.25) 35(-2.25,4.25) 36(-2.75,4.25)
  oval 1.5x0.27 smd: 13(4.25,-2.75) 14(4.25,-2.25) 15(4.25,-1.75) 16(4.25,-1.25) 17(4.25,-0.75) 18(4.25,-0.25) 19(4.25,0.25) 20(4.25,0.75) 21(4.25,1.25) 22(4.25,1.75) 23(4.25,2.25) 24(4.25,2.75) 37(-4.25,2.75) 38(-4.25,2.25) 39(-4.25,1.75) 40(-4.25,1.25) 41(-4.25,0.75) 42(-4.25,0.25) 43(-4.25,-0.25) 44(-4.25,-0.75) 45(-4.25,-1.25) 46(-4.25,-1.75) 47(-4.25,-2.25) 48(-4.25,-2.75)
M5螺丝
  round 8 hole 5: 1(0,0)
OSC-SMD_4P-L3.2-W2.5-BL
  rect 1.4x1.2 smd: 1(-1.1,-0.875) 2(1.1,-0.875) 3(1.1,0.875) 4(-1.1,0.875)
Pad_e1124
  round 1.524 smd: 1(0,0)
Pad_e1126
  round 1.524 smd far side: 1(0,0)
Pad_e1185
  round 1.524 smd: 1(0,0)
Pad_e1198
  round 1.524 smd far side: 1(0,0)
Pad_e1204
  round 1.524 smd: 1(0,0)
Pad_e1207
  round 1.524 smd far side: 1(0,0)
Pad_e1218
  round 1.524 smd: 1(0,0)
Pad_e1223
  round 1.524 smd far side: 1(0,0)
Pad_e1224
  round 1.524 smd: 1(0,0)
Pad_e1225
  round 1.524 smd far side: 1(0,0)
Pad_e1228
  round 1.524 smd: 1(0,0)
Pad_e1229
  round 1.524 smd far side: 1(0,0)
PG-DSO-8_L5.0-W4.0-P1.27-LS6.0-BL
  oval 0.602x1.885 smd: 1(-1.905,-2.743) 2(-0.635,-2.743) 3(0.635,-2.743) 4(1.905,-2.743) 5(1.905,2.743) 6(0.635,2.743) 7(-0.635,2.743) 8(-1.905,2.743)
R0603
  rect 0.806x0.864 smd: 1(-0.753,0) 2(0.753,0)
SOT-89-3_L4.5-W2.5-P1.50-LS4.2-BR
  rect 1.575x0.672 smd: 1(1.356,-1.5) 3(1.356,1.5)
  custom 5.377x1.9 smd: 2(-1.356,0)
USB-C-SMD_TYPE-C-6PIN-2MD-073
  rect 0.55x1.1 smd: 1(-3.2,2.375) 2(-2.4,2.375) 11(2.4,2.375) 12(3.2,2.375)
  rect 0.3x1.1 smd: 3(-1.75,2.375) 4(-1.25,2.375) 5(-0.75,2.375) 6(-0.25,2.375) 7(0.25,2.375) 8(0.75,2.375) 9(1.25,2.375) 10(1.75,2.375)
  oval 1.2x1.8 hole 0.6x1.2: 13(-4.325,-2.375) 14(4.325,-2.375)
  oval 1.1x2 hole 0.6x1.5: 13(-4.325,1.825) 14(4.325,1.825)

## Nets
3.3V: C1.1 C14.2 C15.1 C16.2 C17.2 C18.2 C19.2 CN1.1 H1.5 NOREF#2.1 NOREF#7.1 NOREF#9.1 NOREF#10.1 OSC1.1 OSC1.9 OSC1.24 OSC1.36 OSC1.48 R6.1 R7.1 U1.6 U2#5.2
+5V: C2.1 C3.1 C13.2 R5.1 U2#5.3 USB1.2 USB1.11
GND: C1.2 C2.2 C3.2 C8.1 C9.1 C10.1 C11.1 C13.1 C14.1 C15.2 C16.1 C17.1 C18.1 C19.1 CN1.4 H1.6 LED1.1 LED2.1 NOREF#3.1 NOREF#4.1 NOREF#5.1 NOREF#6.1 OSC1.8 OSC1.23 OSC1.35 OSC1.47 R1.1 R2.1 R9.1 U1.7 U2#5.1 USB1.1 USB1.12
A_CSQ: H1.4 OSC1.38
B_CSQ: OSC1.40 U1.3
BOOT0: NOREF.1 NOREF#11.1 OSC1.44 R9.2
DN: OSC1.32 R3.1
DP: OSC1.33 R4.1
MOSI: H1.2 OSC1.41 U1.4
NRST: NOREF#8.1 NOREF#12.1 OSC1.7
OSC_IN: C9.2 OSC1.5 X2.3
OSC_OUT: C10.2 OSC1.6 X2.1
PC14: C8.2 OSC1.3 X1.2
PC15: C11.2 OSC1.4 X1.1
SCK: H1.3 OSC1.39 U1.2
STATUS_LED: OSC1.2 STATUS.1
SWCLK: CN1.2 OSC1.37
SWDIO: CN1.3 OSC1.34
$1N1867: R2.2 USB1.10
$1N1871: R1.2 USB1.4
$1N2021: R3.2 USB1.5 USB1.7
$1N2036: R4.2 USB1.6 USB1.8
$1N2587: LED1.2 R5.2
$1N2706: LED2.2 R6.2
$1N2839: R7.2 STATUS.2

Pads without a net: H1 1; OSC1 10 11 12 13 14 15 16 17 18 19 20 21 22 25 26 27 28 29 30 31 42 43 45 46; U1 1 5 8; U2 1; U2#2 1; U2#3 1; U2#4 1; USB1 3 9 13 14; X2 2 4

## Via types
v1: diameter 0.61, hole 0.305, Top Layer to Bottom Layer, 43 vias

## Routing (per net, layer and track width the routed paths; a pad name or vN(x,y) marks a point on that pad's centre or on a via; arc(x,y) is an arc through that point)
3.3V: length 178.2
  Top Layer w0.254: v1(34.02,12.47) 33.13,13.36 NOREF#9.1 ; OSC1.1 C18.2 ; OSC1.9 v1(26.36,13.17) C19.2 ; C17.2 OSC1.48 ; OSC1.24 C15.1 ; v1(17,3.86) 17.83,4.68 NOREF#2.1 ; C16.2 OSC1.36
  Top Layer w0.5: H1.5 51.01,22.06 50.99,22.06 50.46,21.53 50.46,21.51 50.34,21.39 50.34,17.91 CN1.1 51.64,16.89 52.5,16.03 52.5,12.85 51.74,12.09 46.58,12.09 35.4,0.92 15.43,0.92 v1(12.5,3.86) C14.2 9.28,12.16 8.56,11.44 8.56,15.28 9.06,15.78 12.96,15.78 ; 34.02,13.94 32.63,15.33 C18.2 ; 34.02,13.94 34.02,24.73 C1.1 U1.6 ; 34.02,13.94 v1(34.02,12.47) C17.2 ; R7.1 R6.1 v1(21.9,19.08) ; v1(33.39,2.19) C16.2 ; v1(20.37,3.86) 21.32,4.81 C15.1
  Bottom Layer w0.254: NOREF#2.1 17.83,4.68 v1(17,3.86) ; 31.72,12.62 31.72,12.65 NOREF#9.1
  Bottom Layer w0.5: 32.94,11.4 31.17,13.17 v1(26.36,13.17) ; 32.94,11.4 v1(34.02,12.47) ; 32.94,11.4 32.94,4.73 32.06,3.84 29.39,3.84 ; 33.32,2.19 31.04,2.19 29.39,3.84 ; 29.39,3.84 20.39,3.84 v1(20.37,3.86) v1(17,3.86) v1(12.5,3.86) ; v1(13,15.78) 13.73,15.78 18.21,20.25 20.72,20.25 v1(21.9,19.08)
+5V: length 42.4
  Top Layer w0.5: v1(13,16.66) 8.69,16.66 7.06,15.04 U2#5.3 7.06,12.62 6.59,12.16 C13.2 4.03,12.75 4.01,12.75 3.77,12.99 3.77,19.3 C2.1 C3.1 3.8,22.06 4.24,22.51 v1(5.13,22.51) ; v1(21.9,20.86) R5.1
  Bottom Layer w0.254: USB1.2 6.3,18.15 5.13,19.32 v1(5.13,22.51) 5.77,22.51 6.21,22.95 USB1.11
  Bottom Layer w0.5: v1(21.9,20.86) 17.96,20.86 13.77,16.66 v1(13,16.66)
GND: length 32.8
  Top Layer w0.254: C1.2 32.94,26.95 U1.7 ; C8.1 v1(20.31,18.19) 15.93,18.19 15.38,17.64 15.38,13.57 ; C9.1 v1(20.31,13.57) ; v1(20.31,13.57) 15.38,13.57 ; v1(20.31,13.57) 20.31,13.62 C11.1 ; C10.1 v1(20.01,9.04) 15.42,9.04 14.91,9.55 14.91,13.11 15.38,13.57
  vias: v1(5.64,14.63) v1(11.23,14.15) v1(13,17.93) v1(18.09,7.39) v1(23.75,14) v1(25.06,10.35) v1(25.06,7.8) v1(25.06,5.25) v1(27.61,10.35) v1(27.61,7.8) v1(27.61,5.25) v1(30.16,10.35) v1(30.16,7.8) v1(30.16,5.25) v1(36.11,3.52)
A_CSQ: length 29.9
  Top Layer w0.254: H1.4 49.84,22.14 49.84,17.21 38.15,5.52 OSC1.38
B_CSQ: length 32.4
  Top Layer w0.254: U1.3 23.29,25.68 v1(22.91,25.3) ; v1(34.21,6.78) 33.96,6.52 OSC1.40
  Bottom Layer w0.254: v1(22.91,25.3) 22.91,22.89 24.05,21.74 31.67,21.74 34.61,18.81 34.61,7.17 v1(34.21,6.78)
BOOT0: length 9.6
  Top Layer w0.254: OSC1.44 33.96,8.52 R9.2 35.24,7.27 v1(36.63,7.27) NOREF.1
  Bottom Layer w0.254: v1(36.63,7.27) NOREF.1
DN: length 36
  Top Layer w0.254: OSC1.32 28.36,2.52 28.41,2.47 28.41,2.22 27.99,1.81 15.8,1.81 14.39,3.21 14.39,19.85 13.5,20.74 12.39,20.74 R3.1
DP: length 36.7
  Top Layer w0.254: OSC1.33 28.86,2.52 28.81,2.47 28.81,2.05 28.16,1.4 15.63,1.4 13.99,3.04 13.99,19.68 13.33,20.34 12.39,20.34 R4.1
MOSI: length 71.9
  Top Layer w0.254: v1(22.15,25.17) 22.91,24.41 U1.4 ; H1.2 49.27,24.07 arc(49.16,23.91) 49.12,23.72 49.12,17.71 arc(49.08,17.52) 48.98,17.36 38.14,6.53 arc(37.98,6.42) 37.79,6.38 35.65,6.38 arc(35.45,6.42) 35.29,6.53 34.6,7.22 arc(34.44,7.32) 34.25,7.36 34.18,7.36 arc(33.99,7.32) 33.83,7.22 33.78,7.17 arc(33.62,7.06) 33.43,7.02 OSC1.41
  Bottom Layer w0.254: v1(22.15,25.17) 22.15,30.12 23.78,31.75 44.65,31.75 50.25,26.16 H1.2
NRST: length 16.9
  Top Layer w0.254: NOREF#8.1 v1(21.77,8.66) 22.15,9.04 22.15,10.57 23.12,11.54 23.12,14.46 23.51,14.86 26.9,14.86 27.36,14.4 OSC1.7
  Bottom Layer w0.254: NOREF#8.1 v1(21.77,8.66)
OSC_IN: length 19.7
  Top Layer w0.254: OSC1.5 28.36,14.4 27.19,15.57 23.22,15.57 22.4,14.76 22.4,11.97 22.15,11.71 20.77,11.71 C9.2 18.82,11.46 17.17,11.46 X2.3
OSC_OUT: length 16.5
  Top Layer w0.254: X2.1 C10.2 20.77,11.2 22.28,11.2 22.76,11.69 22.76,14.61 23.36,15.22 27.04,15.22 27.86,14.4 OSC1.6
PC14: length 16.1
  Top Layer w0.254: X1.2 16.82,17.17 C8.2 20.81,16.28 27.49,16.28 29.36,14.41 OSC1.3
PC15: length 15.6
  Top Layer w0.254: X1.1 19.92,14.63 C11.2 21.22,15.93 27.34,15.93 28.86,14.41 OSC1.4
SCK: length 67.3
  Top Layer w0.254: OSC1.39 38.14,6.02 49.48,17.36 49.48,23.03 H1.3 ; U1.2 23.42,26.95 v1(22.78,27.59)
  Bottom Layer w0.254: v1(22.78,27.59) 22.78,30.25 23.93,31.4 44.51,31.4 50.99,24.91 H1.3
STATUS_LED: length 5.9
  Top Layer w0.254: v1(29.13,16.45) 29.13,15.14 29.86,14.41 OSC1.2
  Bottom Layer w0.254: STATUS.1 v1(29.13,16.45)
SWCLK: length 23.9
  Top Layer w0.254: OSC1.37 38.15,5.02 48.76,15.64 CN1.2
SWDIO: length 29
  Top Layer w0.254: OSC1.34 29.36,2.19 30.12,1.42 35.23,1.42 48.19,14.39 CN1.3
$1N1867: length 3.8
  Top Layer w0.254: v1(8.56,23.14) R2.2
  Bottom Layer w0.254: USB1.10 7.72,22.3 v1(8.56,23.14)
$1N1871: length 4
  Top Layer w0.254: R1.2 9.07,17.93 v1(8.56,18.44)
  Bottom Layer w0.254: v1(8.56,18.44) 7.7,19.3 USB1.4
$1N2021: length 6.5
  Top Layer w0.254: v1(8.56,21.41) R3.2
  Bottom Layer w0.254: v1(8.56,21.41) 7.95,20.8 USB1.7 5.96,20.8 5.77,20.6 5.77,19.97 5.93,19.8 USB1.5
$1N2036: length 8.8
  Top Layer w0.254: R4.2 v1(8.56,19.67)
  Bottom Layer w0.254: USB1.8 7.63,21.3 8.32,21.99 8.8,21.99 9.14,21.65 9.14,20.25 v1(8.56,19.67) 7.93,20.3 USB1.6
$1N2587: length 2
  Top Layer w0.254: R5.2 v1(25.71,20.86)
  Bottom Layer w0.254: LED1.2 26.68,20.86 v1(25.71,20.86)
$1N2706: length 2
  Top Layer w0.254: R6.2 v1(25.75,19.08)
  Bottom Layer w0.254: LED2.2 26.68,19.08 v1(25.75,19.08)
$1N2839: length 2
  Top Layer w0.254: v1(25.75,17.3) R7.2
  Bottom Layer w0.254: STATUS.2 25.75,17.3 v1(25.75,17.3)

## Copper pours and planes (outline as drawn; the poured copper is in the pictures)
GND on Top Layer: 0,41.1 54.94,41.1 54.94,0 0,0
GND on Bottom Layer: 0,41.1 54.94,41.1 54.94,0 0,0

Small or netless copper shapes (teardrops, artwork), in the pictures only: 4 on Top Layer

## Text on the board
Bottom Silkscreen Layer: GND | 3V3 | BOOT | NRST | JRNitre/BEARCat | STA | +5V | NUL | MOS | SCK | ACS | CLK | DIO
Top Silkscreen Layer: Axle-Z_DHS V1.2 | JLCJLCJLCJLC
